# EAGLE design untitled (EAGLE 8.5.0)
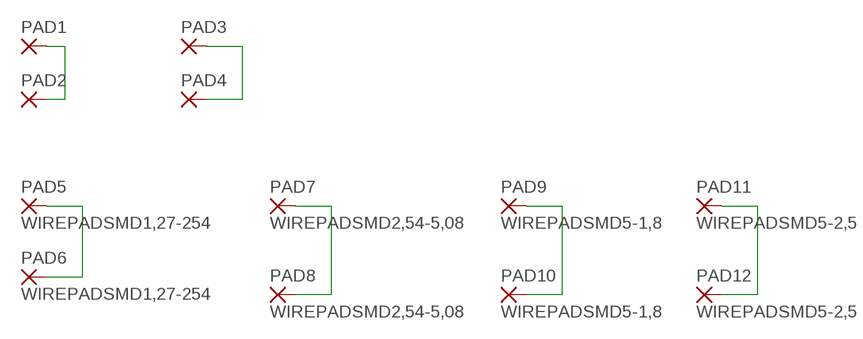
[diagram p0: schematic, sheet 1]

## Parts
PAD1  SMD2  [SMD1,27-2,54]
PAD2  SMD2  [SMD1,27-2,54]
PAD3  SMD5  [SMD2,54-5,08]
PAD4  SMD5  [SMD2,54-5,08]
PAD5  WIREPADSMD1,27-254  [SMD1,27-2,54]
PAD6  WIREPADSMD1,27-254  [SMD1,27-2,54]
PAD7  WIREPADSMD2,54-5,08  [SMD2,54-5,08]
PAD8  WIREPADSMD2,54-5,08  [SMD2,54-5,08]
PAD9  WIREPADSMD5-1,8  [5-1,8]
PAD10  WIREPADSMD5-1,8  [5-1,8]
PAD11  WIREPADSMD5-2,5  [5-2,5]
PAD12  WIREPADSMD5-2,5  [5-2,5]

## Nets
N$1: PAD1.1(P) PAD2.1(P)
N$2: PAD3.1(P) PAD4.1(P)
N$3: PAD5.1(P) PAD6.1(P)
N$4: PAD7.1(P) PAD8.1(P)
N$5: PAD9.1(P) PAD10.1(P)
N$6: PAD11.1(P) PAD12.1(P)

## Library data of the parts
PAD1 PAD2 = wirepad:SMD2: SMD PAD
PAD3 PAD4 = wirepad:SMD5: SMD PAD
PAD5-PAD12 = wirepad:WIREPAD: Wire PAD connect wire on PCB

## Net classes
0 default: width 0.406 mm

## Board
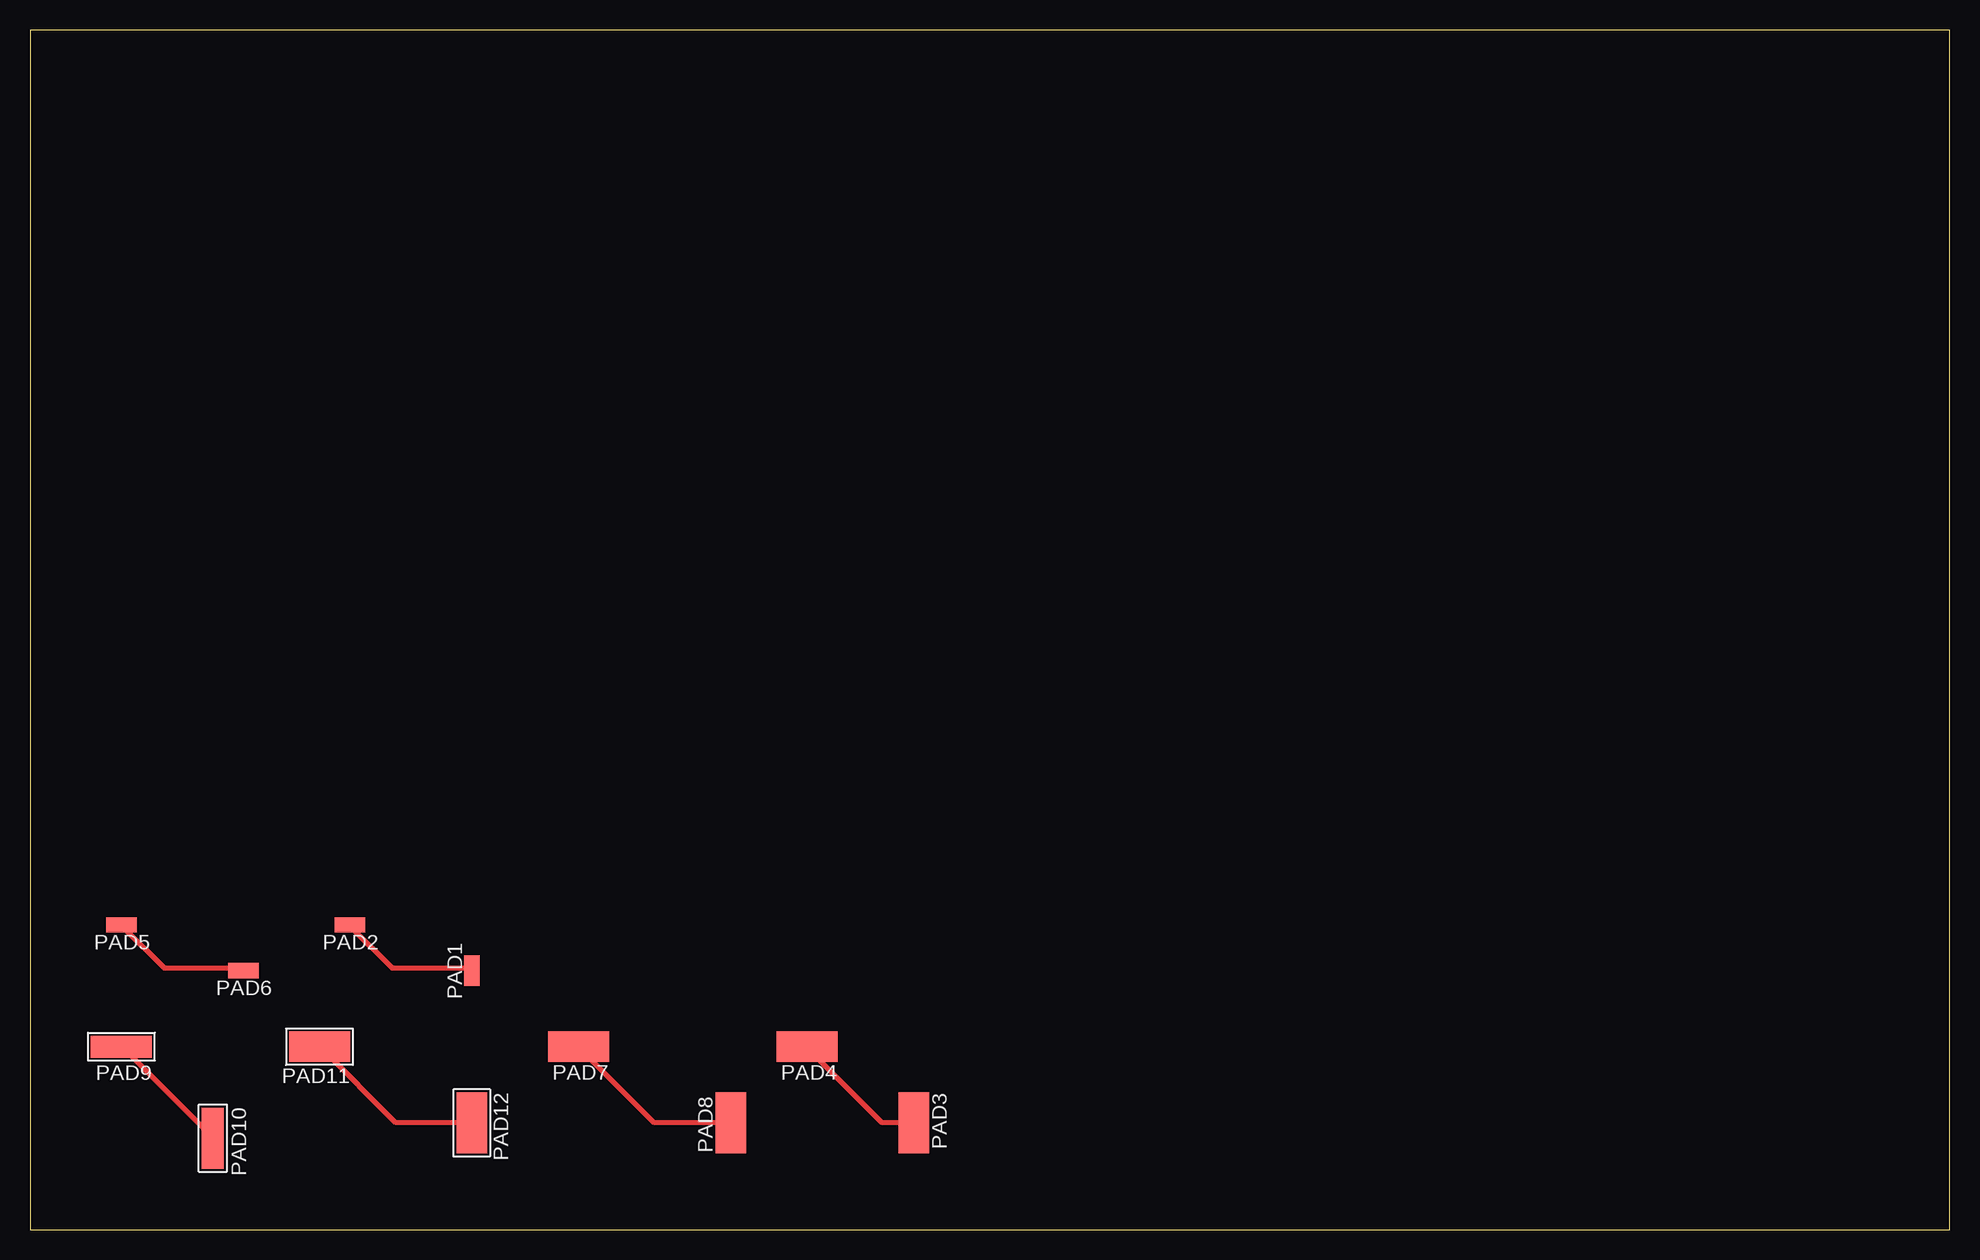
[diagram p1: board, top side]

Size 160 x 100 mm. Coordinates in mm from the lower left corner, seen from the top.
Outline: 0,0 160,0 160,100 0,100 0,0
Copper layers (1*16): Top 0.035mm / dielectric 1.5mm / Bottom 0.035mm
Design rules "default": minimum track width 6mil, minimum drill 0.35mm, track to track 6mil, track to pad 6mil, pad to pad 6mil, via to via 6mil, smd to smd 6mil, copper to edge 40mil, drill to drill 6mil, minimum pad ring 10mil, minimum via ring 8mil, stop-mask expansion 4mil, vias tented up to drill 0mil, thermal gap 10mil

### Footprints (pad centres in the part's own frame; a part is rotated, then mirrored left to right if it is on the bottom)
SMD1,27-2,54 = smd 1.27 x 2.54: 1 0,0
SMD2,54-5,08 = smd 2.54 x 5.08: 1 0,0
5-1,8 = smd 1.829 x 5.08: 1 0,0
5-2,5 = smd 2.54 x 5.08: 1 0,0

### Placement (x,y rotation side)
PAD1  36.83,21.59 0 top
PAD2  26.67,25.4 90 top
PAD3  73.66,8.89 180 top
PAD4  64.77,15.24 90 top
PAD5  7.62,25.4 90 top
PAD6  17.78,21.59 90 top
PAD7  45.72,15.24 90 top
PAD8  58.42,8.89 0 top
PAD9  7.62,15.24 90 top
PAD10  15.24,7.62 180 top
PAD11  24.13,15.24 90 top
PAD12  36.83,8.89 180 top

### Tracks (layer width: path | path; a pad name or v marks a point on that pad's centre or on a via)
N$1
  Top 0.406: PAD1.1 36.6,21.79 30.18,21.79 26.82,25.15 PAD2.1
N$2
  Top 0.406: PAD3.1 73.48,8.94 70.97,8.94 64.82,15.09 PAD4.1
N$3
  Top 0.406: PAD6.1 17.6,21.79 11.18,21.79 7.82,25.15 PAD5.1
N$4
  Top 0.406: PAD8.1 58.4,8.94 51.97,8.94 45.82,15.09 PAD7.1
N$5
  Top 0.406: PAD9.1 7.82,15.09 15.09,7.82 PAD10.1
N$6
  Top 0.406: PAD12.1 36.6,8.94 30.45,8.94 24.31,15.09 PAD11.1